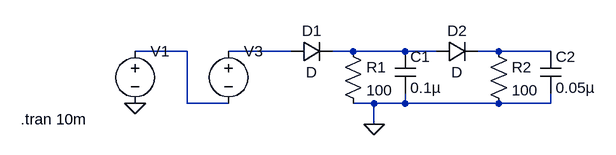
[diagram p0: schematic am_demodulation.asc]
am_demodulation.asc, the LTspice schematic file:
Version 4
SHEET 1 880 680
WIRE 80 144 0 144
WIRE 240 144 144 144
WIRE 336 144 304 144
WIRE 416 144 336 144
WIRE 464 144 416 144
WIRE 560 144 528 144
WIRE 640 144 560 144
WIRE 80 224 80 144
WIRE 144 224 80 224
WIRE 368 224 336 224
WIRE 416 224 416 208
WIRE 416 224 368 224
WIRE 560 224 416 224
WIRE 640 224 640 208
WIRE 640 224 560 224
WIRE 368 256 368 224
FLAG 0 224 0
FLAG 368 256 0
SYMBOL voltage 0 128 R0
WINDOW 3 24 96 Invisible 2
WINDOW 123 0 0 Left 2
WINDOW 39 0 0 Left 2
SYMATTR Value SINE(0 5 1000k 1n)
SYMATTR InstName V1
SYMBOL voltage 144 128 R0
WINDOW 3 24 96 Invisible 2
WINDOW 123 0 0 Left 2
WINDOW 39 0 0 Left 2
SYMATTR Value SINE(0 2v 3k 1n)
SYMATTR InstName V3
SYMBOL diode 240 160 R270
WINDOW 0 32 32 VTop 2
WINDOW 3 0 32 VBottom 2
SYMATTR InstName D1
SYMBOL cap 400 144 R0
SYMATTR InstName C1
SYMATTR Value 0.1µ
SYMBOL res 320 128 R0
SYMATTR InstName R1
SYMATTR Value 100
SYMBOL diode 464 160 R270
WINDOW 0 32 32 VTop 2
WINDOW 3 0 32 VBottom 2
SYMATTR InstName D2
SYMBOL res 544 128 R0
SYMATTR InstName R2
SYMATTR Value 100
SYMBOL cap 624 144 R0
SYMATTR InstName C2
SYMATTR Value 0.05µ
TEXT -176 248 Left 2 !.tran 10m

The netlist it stands for:
* am_demodulation.asc
V1 N001 0 SINE(0 5 1000k 1n)
V3 N002 N001 SINE(0 2v 3k 1n)
D1 N002 N003 D
C1 N003 0 0.1µ
R1 N003 0 100
D2 N003 N004 D
R2 N004 0 100
C2 N004 0 0.05µ
.model D D
.lib standard.dio
.tran 10m
.backanno
.end